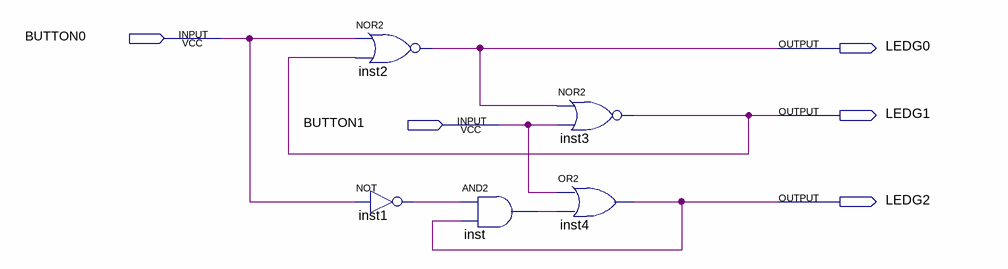
[diagram p0: schematic sheet]
// Quartus schematic lab6.bdf as structural Verilog: 5 symbols, 5 pins
module lab6 (
  input  BUTTON0,
  input  BUTTON1,
  output LEDG0,
  output LEDG1,
  output LEDG2
);

  wire inst1_out, inst_out;

  nor inst2 (LEDG0, BUTTON0, LEDG1);
  not inst1 (inst1_out, BUTTON0);
  and inst (inst_out, inst1_out, LEDG2);
  nor inst3 (LEDG1, LEDG0, BUTTON1);
  or inst4 (LEDG2, BUTTON1, inst_out);
endmodule
